# EAGLE design MelodixMod (EAGLE 9.6.2)
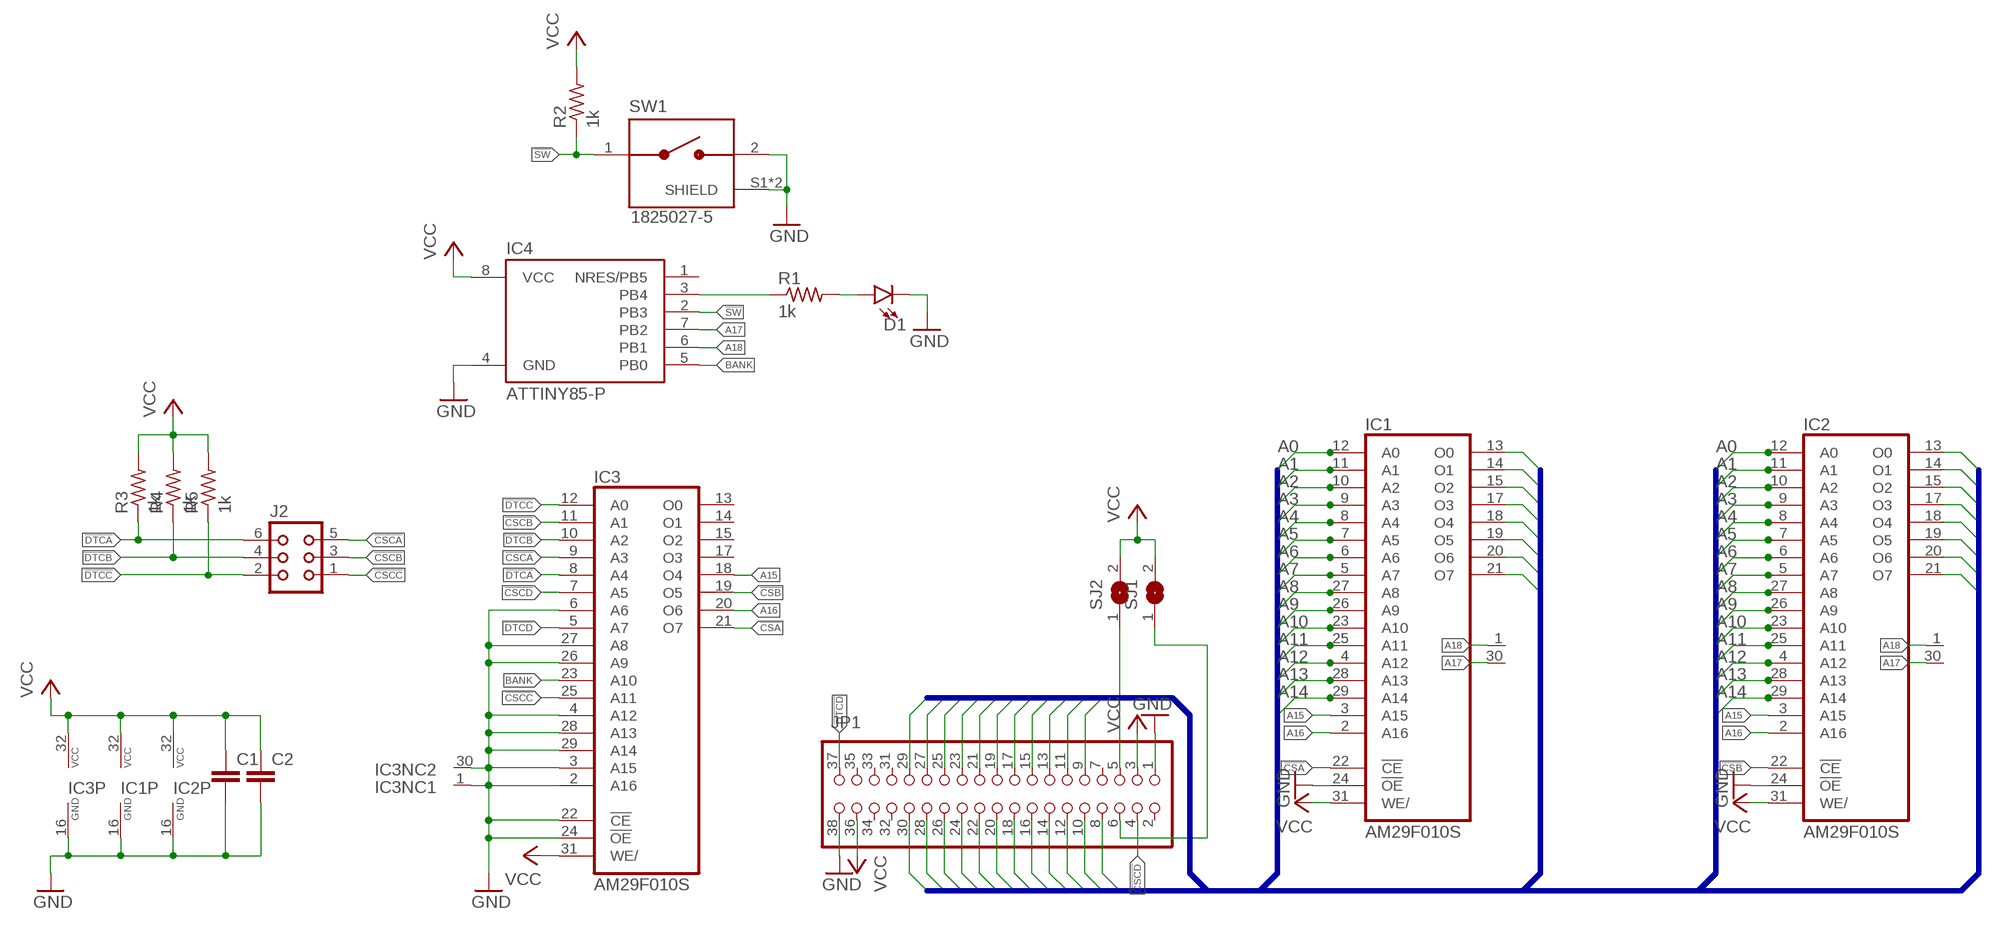
[diagram p0: schematic, sheet 1]

## Parts
C1  C-EU025-024X044  [C025-024X044]
C2  C-EU025-024X044  [C025-024X044]
D1  LED5MM  [LED_5MM]
IC1  AM29F010S  [PLCC-SR32]
IC2  AM29F010S  [PLCC-SR32]
IC3  AM29F010S  [PLCC-SR32]
IC4  ATTINY85-P  [PDIP08_300MIL]
J2  CON06  [CON06]
JP1  FUJISOKU_B_SLOT  [FUJISOKU_B_FP]
R1  1k  R-US_0204/7  [0204/7]
R2  1k  R-US_0204/7  [0204/7]
R3  1k  R-US_0204/7  [0204/7]
R4  1k  R-US_0204/7  [0204/7]
R5  1k  R-US_0204/7  [0204/7]
SJ1  SJ  [SJ]
SJ2  SJ  [SJ]
SW1  1825027-5  [SW_1825027-5]

## Nets
!CSA: IC1.22(!CE) IC3.21(O7)
!CSB: IC2.22(!CE) IC3.19(O5)
!CSCA: IC3.9(A3) J2.5
!CSCB: IC3.11(A1) J2.3
!CSCC: IC3.25(A11) J2.1
!CSCD: IC3.7(A5) JP1.4(!CE1)
!DTCA: IC3.8(A4) J2.6 R3.1
!DTCB: IC3.10(A2) J2.4 R4.1
!DTCC: IC3.12(A0) J2.2 R5.1
!DTCD: IC3.5(A7) JP1.37(!CARD_DET)
!SW: IC4.2(PB3) R2.1 SW1.1
A0: IC1.12(A0) IC2.12(A0) JP1.16(A0)
A1: IC1.11(A1) IC2.11(A1) JP1.17(A1)
A2: IC1.10(A2) IC2.10(A2) JP1.18(A2)
A3: IC1.9(A3) IC2.9(A3) JP1.19(A3)
A4: IC1.8(A4) IC2.8(A4) JP1.20(A4)
A5: IC1.7(A5) IC2.7(A5) JP1.21(A5)
A6: IC1.6(A6) IC2.6(A6) JP1.22(A6)
A7: IC1.5(A7) IC2.5(A7) JP1.23(A7)
A8: IC1.27(A8) IC2.27(A8) JP1.24(A8)
A9: IC1.26(A9) IC2.26(A9) JP1.25(A9)
A10: IC1.23(A10) IC2.23(A10) JP1.26(A10)
A11: IC1.25(A11) IC2.25(A11) JP1.27(A11)
A12: IC1.4(A12) IC2.4(A12) JP1.28(A12)
A13: IC1.28(A13) IC2.28(A13) JP1.29(A13)
A14: IC1.29(A14) IC2.29(A14) JP1.30(A14)
A15: IC1.3(A15) IC2.3(A15) IC3.18(O4)
A16: IC1.2(A16) IC2.2(A16) IC3.20(O6)
A17: IC1.30(NC) IC2.30(NC) IC4.7(PB2)
A18: IC1.1(NC) IC2.1(NC) IC4.6(PB1)
BANK: IC3.23(A10) IC4.5(PB0)
D0: IC1.13(O0) IC2.13(O0) JP1.8(D0)
D1: IC1.14(O1) IC2.14(O1) JP1.9(D1)
D2: IC1.15(O2) IC2.15(O2) JP1.10(D2)
D3: IC1.17(O3) IC2.17(O3) JP1.11(D3)
D4: IC1.18(O4) IC2.18(O4) JP1.12(D4)
D5: IC1.19(O5) IC2.19(O5) JP1.13(D5)
D6: IC1.20(O6) IC2.20(O6) JP1.14(D6)
D7: IC1.21(O7) IC2.21(O7) JP1.15(D7)
GND: C1.2 C2.2 D1.K(C) IC1.16(GND) IC1.24(!OE) IC2.16(GND) IC2.24(!OE) IC3.1(NC) IC3.2(A16) IC3.3(A15) IC3.4(A12) IC3.6(A6) IC3.16(GND) IC3.22(!CE) IC3.24(!OE) IC3.26(A9) IC3.27(A8) IC3.28(A13) IC3.29(A14) IC3.30(NC) IC4.4(GND) JP1.1(GND) JP1.38(GND) SW1.2 SW1.S1(SHIELD) SW1.S2(SHIELD)
N$1: IC4.3(PB4) R1.1
N$2: D1.A R1.2
N$4: JP1.5(CE2) SJ2.1
N$5: JP1.6(!WE) SJ1.1
VCC: C1.1 C2.1 IC1.31(WE/) IC1.32(VCC) IC2.31(WE/) IC2.32(VCC) IC3.31(WE/) IC3.32(VCC) IC4.8(VCC) JP1.3(VCC) JP1.36(VCC) R2.2 R3.2 R4.2 R5.2 SJ1.2 SJ2.2
Unconnected: IC3.13(O0) IC3.14(O1) IC3.15(O2) IC3.17(O3) IC4.1(NRES/PB5) JP1.2(BATT_DET) JP1.7(!OE) JP1.31(A15) JP1.32(A16) JP1.33(A17) JP1.34(A18) JP1.35(A19)

## Buses
A[0..14],D[0..7]

## Library data of the parts
C1 C2 = rcl:C-EU: CAPACITOR, European symbol; SPICEPREFIX: C
D1 = SparkFun-LED:LED: LED (Generic) Standard schematic elements and footprints for 5mm, 3mm, 1206, and 0603 sized LEDs. Generic LEDs with no color specified.
IC1-IC3 = am29-memory:AM29F010S: 1-Megabit FLASH MEMORY (128 K x 8 bit) 5 V-only
IC4 = _hhn_attiny25_45_85:ATTINY85*: ATMEL ATtiny 85 Packages: P = PDIP 08 30mil S = SOIC 08 EIAJ 208mil Technologies Note: for complete ordering code (temp. range, finish, tape&reel etc.) see www.atmel.com • Supply Voltage: V = (1.8…5.5)V | [blank] = (2.7…5.5)V • Speed: 10 = 10 MHz | 20 = 20 MHz Author: Dipl.-Ing. FH Rainer Bayer HHN Hochschule Heilbronn (Heilbronn University), rainer.bayer@hs-heilbronn.de Ingenieurbüro ing-rb, mail@ing-rb.de
J2 = con-harting:CON06: CONNECTOR; OC_FARNELL: unknown; OC_NEWARK: unknown
JP1 = FujisokuBSeries:FUJISOKU_B_SLOT: PIN HEADER
R1-R5 = rcl:R-US_: RESISTOR, American symbol; SPICEPREFIX: R
SJ1 SJ2 = jumper:SJ: SMD solder JUMPER
SW1 = 1825027-5:1825027-5: Switch Push Button OFF (ON) SPST Round Button 0.05A 24VDC Momentary Contact PC Pins Thru-Hole; COMMENT: 1825027-5; CONFIGURATION_(POLE-THROW): Single Pole - Single Throw; CONTACT_CURRENT_RATING: 50 mA; DESCRIPTION: FSMRA2JH04=R/A,TACT PB SW,160G; DIGI-KEY_PART_NUMBER: 450-1662-ND; DIGI-KEY_PURCHASE_URL: https://www.digikey.com/product-detail/en/te-connectivity-alcoswitch-switches/1825027-5/450-1662-ND/529484?WT.z_cid=ref_snapeda&utm_source=snapeda&utm_medium=aggregator&utm_campaign=buynow; EU_ROHS_COMPLIANCE: Compliant; LINK: http://www.te.com/usa-en/product-1825027-5.html; MF: TE Connectivity; MP: 1825027-5; PACKAGE: None

## Board
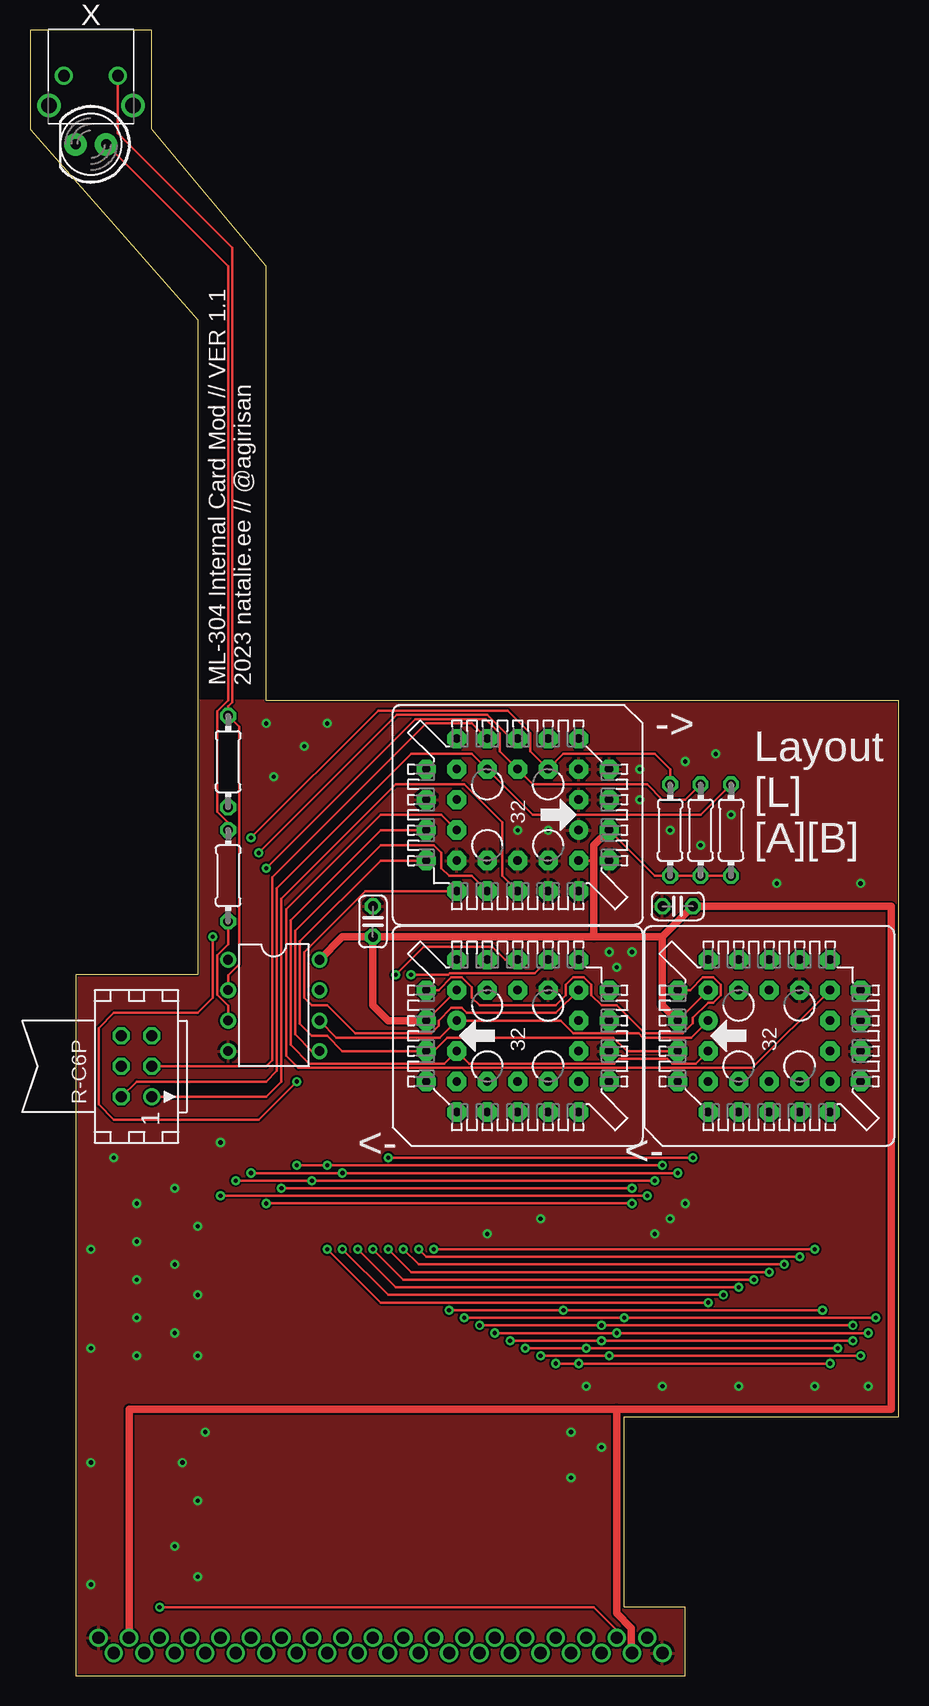
[diagram p1: board, top side]
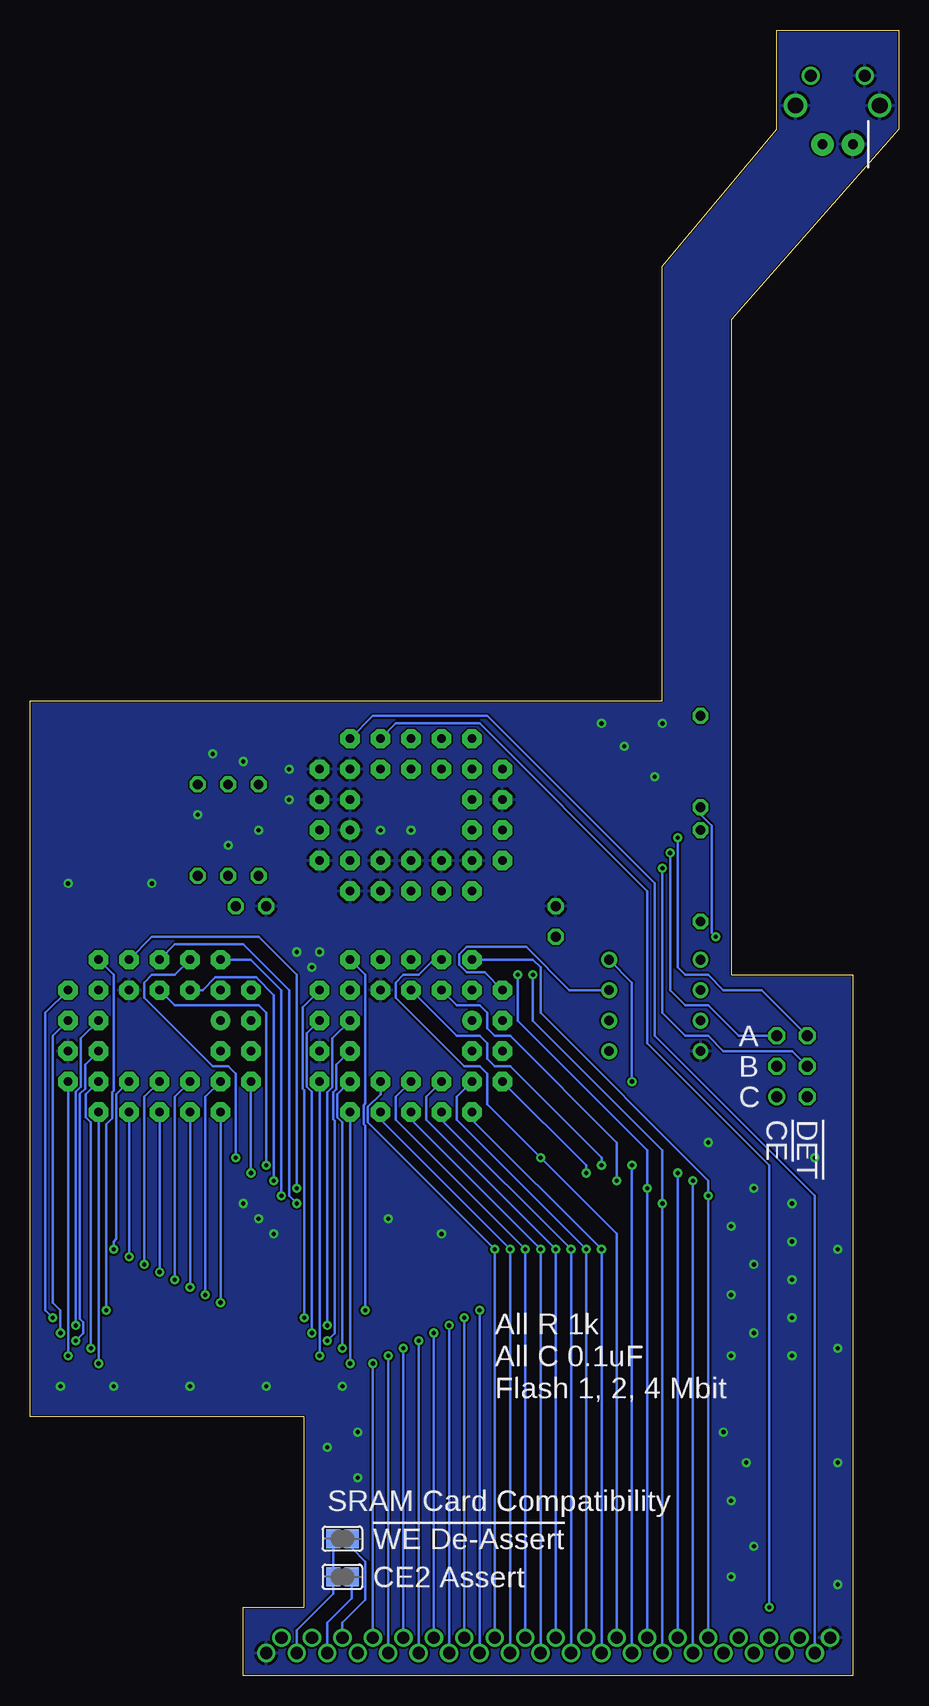
[diagram p2: board, bottom side, seen from below]

Size 72.39 x 137.16 mm. Coordinates in mm from the lower left corner, seen from the top.
Outline: 3.81,0 54.61,0 54.61,5.71 49.53,5.71 49.53,21.59 72.39,21.59 72.39,81.28 19.69,81.28 19.69,117.47 10.16,128.91 10.16,137.16 0,137.16 0,128.91 13.97,113.03 13.97,58.42 3.81,58.42 3.81,0
Copper layers (1*16): Top 0.035mm / dielectric 1.5mm / Bottom 0.035mm
Design rules "default *": minimum track width 6mil, minimum drill 0.35mm, track to track 6mil, track to pad 6mil, pad to pad 6mil, via to via 6mil, smd to smd 6mil, copper to edge 6mil, drill to drill 6mil, minimum pad ring 10mil, minimum via ring 8mil, stop-mask expansion 4mil, vias tented up to drill 100mil, thermal gap 10mil

### Footprints (pad centres in the part's own frame; a part is rotated, then mirrored left to right if it is on the bottom)
C025-024X044 = drill 0.813 octagon: 1 -1.27,0; 2 1.27,0
LED_5MM = drill 0.813 pad 1.88: A -1.27,0; K 1.27,0
PLCC-SR32 = drill 0.7 pad 1.6: 1 1.27,5.08 | drill 0.7 pad 1.6 octagon: 2 -1.27,7.62; 3 -1.27,5.08; 4 -3.81,7.62; 5 -6.35,5.08; 6 -3.81,5.08; 7 -6.35,2.54; 8 -3.81,2.54; 9 -6.35,0; 10 -3.81,0; 11 -6.35,-2.54; 12 -3.81,-2.54; 13 -6.35,-5.08; 14 -3.81,-7.62; 15 -3.81,-5.08; 16 -1.27,-7.62; 17 -1.27,-5.08; 18 1.27,-7.62; 19 1.27,-5.08; 20 3.81,-7.62; 21 6.35,-5.08; 22 3.81,-5.08; 23 6.35,-2.54; 24 3.81,-2.54; 25 6.35,0; 26 3.81,0; 27 6.35,2.54; 28 3.81,2.54; 29 6.35,5.08; 30 3.81,7.62; 31 3.81,5.08; 32 1.27,7.62
PDIP08_300MIL = drill 0.813: 1 -3.81,-3.81; 2 -1.27,-3.81; 3 1.27,-3.81; 4 3.81,-3.81; 5 3.81,3.81; 6 1.27,3.81; 7 -1.27,3.81; 8 -3.81,3.81
CON06 = drill 0.914: 1 -2.54,-1.27 | drill 0.914 octagon: 2 -2.54,1.27; 3 0,-1.27; 4 0,1.27; 5 2.54,-1.27; 6 2.54,1.27
FUJISOKU_B_FP = drill 1.016: 1 22.86,-0.635; 2 21.59,0.635; 3 20.32,-0.635; 4 19.05,0.635; 5 17.78,-0.635; 6 16.51,0.635; 7 15.24,-0.635; 8 13.97,0.635; 9 12.7,-0.635; 10 11.43,0.635; 11 10.16,-0.635; 12 8.89,0.635; 13 7.62,-0.635; 14 6.35,0.635; 15 5.08,-0.635; 16 3.81,0.635; 17 2.54,-0.635; 18 1.27,0.635; 19 0,-0.635; 20 -1.27,0.635; 21 -2.54,-0.635; 22 -3.81,0.635; 23 -5.08,-0.635; 24 -6.35,0.635; 25 -7.62,-0.635; 26 -8.89,0.635; 27 -10.16,-0.635; 28 -11.43,0.635; 29 -12.7,-0.635; 30 -13.97,0.635; 31 -15.24,-0.635; 32 -16.51,0.635; 33 -17.78,-0.635; 34 -19.05,0.635; 35 -20.32,-0.635; 36 -21.59,0.635; 37 -22.86,-0.635; 38 -24.13,0.635
0204/7 = drill 0.813 octagon: 1 -3.81,0; 2 3.81,0
SJ = smd 1.168 x 1.6: 1 -0.762,0; 2 0.762,0
SW_1825027-5 = drill 0.99: 1 -2.25,0; 2 2.25,0 | drill 1.3: S1 -3.505,2.49; S2 3.505,2.49

### Placement (x,y rotation side)
C1  28.58,62.86 90 top
C2  53.98,64.14 180 top
D1  5.08,127.63 180 top
IC1  40.64,53.34 90 top
IC2  61.59,53.34 90 top
IC3  40.64,71.75 270 top
IC4  20.32,55.88 270 top
J2  8.89,50.8 90 top
JP1  29.85,2.54 0 top
R1  16.51,66.67 90 top
R2  16.51,76.2 270 top
R3  53.34,70.48 270 top
R4  55.88,70.48 270 top
R5  58.42,70.48 270 top
SJ1  46.36,11.43 180 bottom
SJ2  46.36,8.25 180 bottom
SW1  5.08,133.35 180 top

### Tracks (layer width: path | path; a pad name or v marks a point on that pad's centre or on a via)
!CSA
  Top 0.203: IC3.21 27.94,65.41 22.86,60.32 22.86,56.52 23.5,55.88 24.77,55.88 27.09,53.56 33.46,53.56 34.07,54.17 34.07,54.61 35.12,55.66 36,55.66 36.42,55.24 43.82,55.24 IC1.22
!CSB
  Top 0.203: IC2.22 60.19,50.66 22.37,50.66 21.34,51.69 21.34,63.88 29.21,71.75 34.29,71.75 IC3.19
!CSCA  (via drill 0.35)
  Top 0.203: IC3.9 40.09,78.11 38.11,80.09 30.56,80.09 v19.05,68.58
  Bottom 0.203: J2.5 13.34,53.34 15.88,55.88 17.78,55.88 19.05,57.15 v19.05,68.58
!CSCB
  Top 0.203: IC3.11 36.83,79.38 33.02,79.38 20.19,66.55 20.19,51.31 19.69,50.8 J2.3
!CSCC
  Top 0.203: J2.1 19.69,48.26 20.96,49.53 20.96,64.77 30.48,74.3 36.2,74.3 39.37,71.12 39.37,66.67 IC3.25
!CSCD  (via drill 0.35)
  Top 0.203: v10.8,5.71 46.99,5.71 48.9,3.81 JP1.4
  Bottom 0.203: v10.8,5.71 10.8,42.54 20.96,52.7 20.96,65.41 34.92,79.38 41.91,79.38 IC3.7
!DTCA  (via drill 0.35)
  Top 0.203: v18.41,69.85 29.01,80.44 39.79,80.44 41.69,78.54 41.69,77.05 IC3.8 44.45,76.83 52.07,76.83 53.34,75.56 R3.1
  Bottom 0.203: J2.6 11.43,57.15 14.61,57.15 15.88,58.42 17.78,58.42 18.41,59.05 v18.41,69.85
!DTCB  (via drill 0.35)
  Top 0.203: v19.69,67.31 32.11,79.73 37.97,79.73 39.15,78.54 39.15,77.05 IC3.10 41.91,74.3 51.44,74.3 52.71,73.02 54.61,73.02 R4.1
  Bottom 0.203: J2.4 8.89,52.07 14.61,52.07 15.88,53.34 17.78,53.34 19.69,55.24 v19.69,67.31
!DTCC
  Top 0.203: J2.2 8.89,49.53 19.69,49.53 20.57,50.42 20.57,65.66 31.75,76.83 36.83,76.83 IC3.12 41.91,71.75 55.88,71.75 R5.1
!DTCD
  Bottom 0.203: JP1.37 6.98,40 20.32,53.34 20.32,66.04 34.29,80.01 43.82,80.01 IC3.5
!SW
  Top 0.203: IC4.2 16.51,58.4 17.42,59.31 17.42,79.1 R2.1 16.51,80.8 16.87,81.16 16.87,119.02 7.33,128.56 SW1.1
A0  (via drill 0.35)
  Top 0.203: v33.66,35.56 v65.41,35.56
  Bottom 0.203: JP1.16 v33.66,35.56 44.23,46.14 44.23,47.43 43.18,48.48 IC1.12 | IC2.12 65.19,48.48 65.19,36.41 65.41,36.2 v65.41,35.56
A1  (via drill 0.35)
  Top 0.203: v32.39,35.56 33.02,34.92 v64.14,34.92
  Bottom 0.203: JP1.17 v32.39,35.56 43.18,46.35 IC1.11 | v64.14,34.92 IC2.11
A2  (via drill 0.35)
  Top 0.203: v31.12,35.56 32.39,34.29 v62.87,34.29
  Bottom 0.203: JP1.18 v31.12,35.56 41.91,46.35 41.91,48.26 IC1.10 | v62.87,34.29 62.87,48.26 IC2.10
A3  (via drill 0.35)
  Top 0.203: v29.85,35.56 31.75,33.66 v61.59,33.66
  Bottom 0.203: JP1.19 v29.85,35.56 40.64,46.35 IC1.9 | IC2.9 v61.59,33.66
A4  (via drill 0.35)
  Top 0.203: v28.58,35.56 31.12,33.02 v60.33,33.02
  Bottom 0.203: JP1.20 v28.58,35.56 39.37,46.35 39.37,48.26 IC1.8 | IC2.8 60.33,48.26 v60.33,33.02
A5  (via drill 0.35)
  Top 0.203: v27.31,35.56 30.48,32.38 v59.05,32.38
  Bottom 0.203: JP1.21 v27.31,35.56 38.1,46.35 IC1.7 | IC2.7 v59.05,32.38
A6  (via drill 0.35)
  Top 0.203: v26.04,35.56 29.85,31.75 v57.79,31.75
  Bottom 0.203: JP1.22 v26.04,35.56 36.83,46.35 36.83,48.26 IC1.6 | IC2.6 57.79,48.26 v57.79,31.75
A7  (via drill 0.35)
  Top 0.203: v24.77,35.56 29.21,31.12 v56.52,31.12
  Bottom 0.203: JP1.23 v24.77,35.56 35.56,46.35 IC1.5 | IC2.5 v56.52,31.12
A8  (via drill 0.35)
  Top 0.203: v29.85,43.18 v55.25,43.18
  Bottom 0.203: JP1.24 23.5,36.83 v29.85,43.18 34.29,47.62 34.29,50.16 34.92,50.8 36.2,50.8 41.91,56.52 41.91,57.78 41.28,58.42 40.01,58.42 38.73,59.69 IC1.27 | IC2.27 60.33,58.42 62.23,58.42 62.87,57.78 62.87,56.52 57.15,50.8 55.88,50.8 55.25,50.16 v55.25,43.18
A9  (via drill 0.35)
  Top 0.203: v22.23,42.54 v24.77,42.54 v52.71,42.54
  Bottom 0.203: JP1.25 v22.23,42.54 | IC2.26 60.33,55.88 53.34,55.88 52.71,55.24 v52.71,42.54 | IC1.26 36.83,53.34 34.92,53.34 34.29,52.7 34.29,51.43 33.66,50.8 32.39,50.8 24.77,43.18 v24.77,42.54
A10  (via drill 0.35)
  Top 0.203: v50.16,40.64 v20.96,40.64 | v31.75,58.42 34.84,58.42 34.98,58.56 42.05,58.56 IC1.23
  Bottom 0.203: JP1.26 v20.96,40.64 20.96,43.81 31.75,54.61 v31.75,58.42 | IC2.23 62.23,61.59 53.34,61.59 50.16,58.42 v50.16,40.64
A11  (via drill 0.35)
  Top 0.203: IC1.25 39.59,59.69 38.54,60.74 32.8,60.74 v30.48,58.42 | v50.16,39.37 v19.69,39.37
  Bottom 0.203: JP1.27 v19.69,39.37 19.69,43.81 30.48,54.61 v30.48,58.42 | IC2.25 60.33,60.96 54.61,60.96 50.8,57.15 50.8,40 v50.16,39.37
A12  (via drill 0.35)
  Top 0.203: v53.98,41.91 v26.04,41.91 v18.41,41.91
  Bottom 0.203: JP1.28 v18.41,41.91 | IC2.4 v53.98,41.91 | IC1.4 26.04,42.54 v26.04,41.91
A13  (via drill 0.35)
  Top 0.203: v52.07,41.27 v23.5,41.27 v17.15,41.27
  Bottom 0.203: v17.15,41.27 JP1.29 | IC2.28 58.01,57.15 56.95,58.2 53.54,58.2 52.07,56.74 v52.07,41.27 | IC1.28 36.83,55.88 34.92,55.88 34.29,55.24 34.29,53.97 33.66,53.34 32.39,53.34 23.5,44.45 v23.5,41.27
A14  (via drill 0.35)
  Top 0.203: v51.44,40 v15.88,40
  Bottom 0.203: JP1.30 v15.88,40 15.88,41.27 29.85,55.24 29.85,59.05 30.48,59.69 IC1.29 | IC2.29 53.98,59.69 51.44,57.15 v51.44,40
A15
  Top 0.203: IC2.3 55.46,51.02 53.54,51.02 53.12,51.43 49.12,51.43 48.7,51.02 36.61,51.02 IC1.3 34.51,51.02 23.28,51.02 21.72,52.58 21.72,62.99 29.21,70.48 IC3.18
A16
  Top 0.203: IC2.2 49.75,52.07 48.62,53.2 34.79,53.2 33.66,52.07 IC1.2 26.04,52.07 24.77,53.34 23.5,53.34 22.48,54.36 22.48,61.21 29.21,67.94 IC3.20
A17
  Top 0.203: IC2.30 55.02,57.15 56.08,58.2 56.95,58.2 57.57,57.59 57.57,56.71 56.95,56.1 56.51,56.1 55.25,54.83 55.25,54.39 54.41,53.56 51.22,53.56 48.9,55.88 47.62,55.88 46.77,56.73 46.77,57.59 46.16,58.2 45.28,58.2 44.67,57.59 44.67,56.73 43.82,55.88 37.47,55.88 36.83,56.52 36.83,57.37 36,58.2 35.12,58.2 34.07,57.15 IC1.30
  Bottom 0.203: IC4.7 27.44,57.15 31.03,60.74 36,60.74 36.61,60.13 36.61,59.25 36,58.64 34.51,58.64 IC1.30
A18
  Top 0.203: IC2.1 55.11,53.2 51.07,53.2 50.72,53.56 45.28,53.56 44.23,54.61 IC1.1 34.15,53.2 25.54,53.2 IC4.6
BANK
  Top 0.203: IC4.5 23.5,52.07 22.1,53.47 22.1,62.1 29.21,69.22 33.66,69.22 34.29,68.58 34.29,67.31 34.92,66.67 36.83,66.67 IC3.23
D0  (via drill 0.35)
  Top 0.203: v43.82,26.04 v45.72,26.04 v66.67,26.04
  Bottom 0.203: JP1.8 v43.82,26.04 | IC1.13 v45.72,26.04 | IC2.13 v66.67,26.04
D1  (via drill 0.35)
  Top 0.203: v42.55,26.67 v48.26,26.67 v69.22,26.67
  Bottom 0.203: JP1.9 v42.55,26.67 | IC1.14 v48.26,26.67 | IC2.14 v69.22,26.67
D2  (via drill 0.35)
  Top 0.203: v41.28,27.3 v46.36,27.3 v67.31,27.3
  Bottom 0.203: IC1.15 46.77,48.48 46.77,46.55 46.36,46.13 v46.36,27.3 | JP1.10 v41.28,27.3 | v67.31,27.3 67.31,46.13 67.73,46.55 67.73,48.48 IC2.15
D3  (via drill 0.35)
  Top 0.203: v40.01,27.94 v47.62,27.94 v68.58,27.94
  Bottom 0.203: IC1.17 46.85,50.94 46.85,48.9 47.13,48.62 47.13,46.41 46.99,46.27 46.99,28.57 v47.62,27.94 | JP1.11 v40.01,27.94 | IC2.17 67.81,50.94 67.81,48.95 68.22,48.53 68.22,29.75 67.95,29.47 67.95,28.57 v68.58,27.94
D4  (via drill 0.35)
  Top 0.203: v38.73,28.57 v48.9,28.57 v69.85,28.57
  Bottom 0.203: JP1.12 v38.73,28.57 | IC1.18 49.31,53.56 49.31,49.09 48.9,48.67 v48.9,28.57 | v69.85,28.57 69.85,30.48 70.48,31.12 70.48,53.34 IC2.18
D5  (via drill 0.35)
  Top 0.203: v37.47,29.21 v47.62,29.21 v68.58,29.21
  Bottom 0.203: IC1.19 47.21,53.12 47.21,49.05 47.62,48.63 v47.62,29.21 | JP1.13 v37.47,29.21 | IC2.19 68.16,53.12 68.16,49.09 68.58,48.67 v68.58,29.21
D6  (via drill 0.35)
  Top 0.203: v36.2,29.85 v49.53,29.85 v70.48,29.85
  Bottom 0.203: JP1.14 v36.2,29.85 | v49.53,29.85 49.53,48.81 49.67,48.95 49.67,55.74 IC1.20 | IC2.20 71.12,55.24 71.12,30.48 v70.48,29.85
D7  (via drill 0.35)
  Top 0.203: v34.92,30.48 v44.45,30.48 v66.04,30.48
  Bottom 0.203: JP1.15 v34.92,30.48 | IC1.21 44.45,58.42 44.45,47.71 44.59,47.57 44.59,45.99 44.45,45.85 v44.45,30.48 | IC2.21 65.41,58.42 65.41,48.76 65.55,48.62 65.55,46.47 66.04,45.98 v66.04,30.48
GND  (via drill 0.35)
  other vias: 48.26,60.32 50.16,60.32 48.9,59.05 22.86,77.47 19.69,79.38 20.32,74.93 54.61,76.2 55.88,69.22 53.34,70.48 62.23,66.04 69.22,66.04 54.61,39.37 53.34,38.1 52.07,36.83 46.36,24.13 52.71,24.13 59.05,24.13 65.41,24.13 69.85,24.13 15.88,44.45 12.07,40.64 13.97,37.46 12.07,34.29 13.97,31.75 12.07,28.57 13.97,26.67 8.89,39.37 8.89,36.2 8.89,33.02 8.89,29.85 8.89,26.67 14.61,20.32 12.7,17.78 13.97,14.61 12.07,10.79 13.97,8.25 5.08,7.62 5.08,17.78 5.08,27.3 5.08,35.56 6.98,43.18 45.09,20.32 47.62,19.05 45.09,16.51 24.77,79.38 38.1,36.83 42.55,38.1 58.42,71.75 50.8,75.56 50.8,73.02 40.64,70.48 43.18,70.48 57.15,76.83
  pour Top: 3.18,81.28 73.03,81.28 73.03,-0.64 3.18,-0.64
  pour Bottom: -8.25,-2.54 81.28,-2.54 81.28,140.34 -8.25,140.34
N$1
  Top 0.203: IC4.3 16.51,55.86 15.6,56.77 15.6,60.07 16.51,60.98 R1.1
N$2
  Top 0.203: R1.2 16.51,71.1 15.6,72.01 15.6,80.39 16.51,81.3 16.51,117.47 D1.A
N$4
  Bottom 0.203: SJ2.1 45.59,6.48 47.62,4.45 JP1.5
N$5
  Bottom 0.203: SJ1.1 45.59,10.67 44.45,9.52 44.45,6.35 46.36,4.45 JP1.6
VCC  (via drill 0.35)
  Top 0.203: IC2.32 IC2.31 | IC1.32 IC1.31 | v15.24,61.59 15.24,56.52 13.97,55.24 6.98,55.24 5.72,53.97 5.72,47.62 6.98,46.35 19.05,46.35 v22.23,49.53 | IC3.31 46.99,67.94 | R5.2 R4.2 R3.2 52.07,66.67 IC3.32
  Top 0.61: 48.9,22.23 48.9,5.21 50.11,3.99 50.11,1.96 JP1.3 | 48.9,22.23 71.75,22.23 71.75,64.14 C2.1 52.71,61.59 | 52.71,61.59 46.99,61.59 | IC2.32 52.71,55.88 52.71,61.59 | IC3.32 46.99,69.22 46.99,67.94 46.99,61.59 | 46.99,61.59 C1.1 | C1.1 28.58,55.88 29.85,54.61 IC1.32 | C1.1 26.04,61.59 IC4.8 | JP1.36 8.26,22.23 48.9,22.23
  Bottom 0.203: R2.2 16.51,71.78 15.6,70.86 15.6,61.95 v15.24,61.59 | v22.23,49.53 22.23,57.78 IC4.8 | SJ1.2 SJ2.2 47.12,6.86 50.16,3.81 JP1.3

### Text on the board
tNames: X | ML-304 Internal Card Mod // VER 1.1 / 2023 natalie.ee // @agirisan | -> | Layout / [L] / [A][B] | <- | <-
bNames: A | B | C | !DET | !CE | All R 1k / All C 0.1uF / Flash 1, 2, 4 Mbit | SRAM Card Compatibility | !WE De-Assert | CE2 Assert